# EAGLE design CARduino (EAGLE 7.1.0)
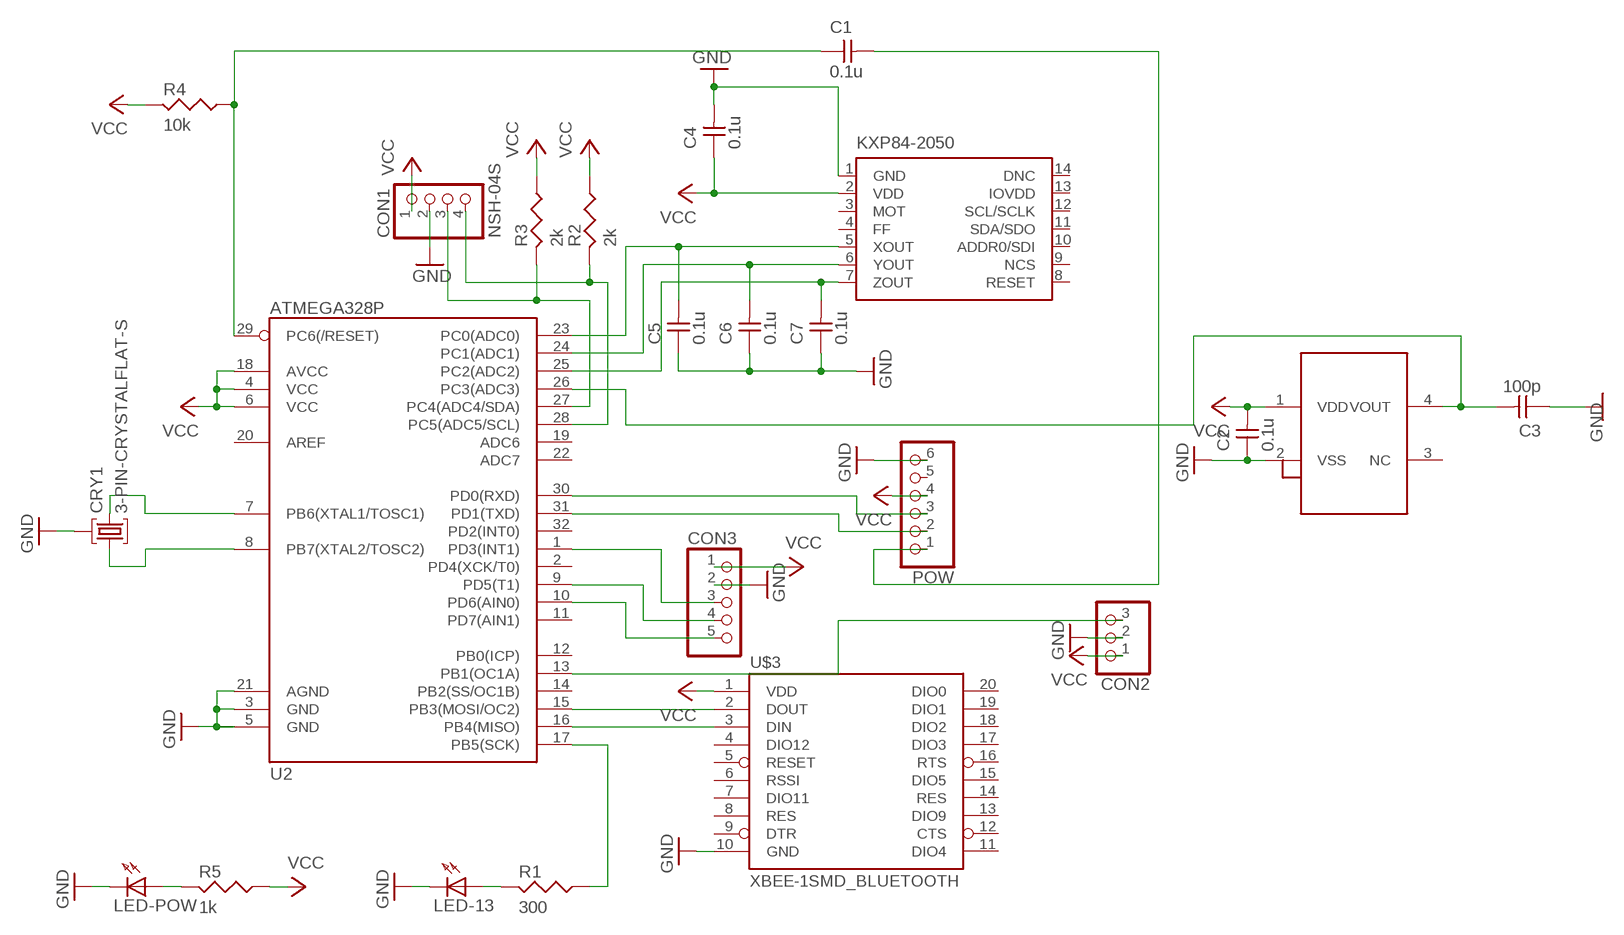
[diagram p0: schematic, sheet 1]

## Parts
C1  0.1u  1608  [1608]
C2  0.1u  1608  [1608]
C3  100p  1608  [1608]
C4  0.1u  1608  [1608]
C5  0.1u  1608  [1608]
C6  0.1u  1608  [1608]
C7  0.1u  1608  [1608]
CON1  NSH-04S  [NSH-04-S]
CON2  NSH-03S  [NSH-03-S]
CON3  PINHD-1X5DIP  [1X05]
CRY1  3-PIN-CRYSTALFLAT-S  [CRYSTAL-CSTCE8M]
LED-13  1608  [1608]
LED-POW  1608  [1608]
POW  PINHD-1X6NORMAL  [1X06]
R1  300  1608  [1608]
R2  2k  1608  [1608]
R3  2k  1608  [1608]
R4  10k  1608  [1608]
R5  1k  1608  [1608]
S1  TEMPERATURE-S8120C  [SC-82AB]
U2  ATMEGA328P  ATMEGA328_SMT  [TQFP32-08]
U$1  KXP84-2050  [DFN14-5X5]
U$3  XBEE-1SMD_BLUETOOTH  [XBEE-SMD_BLUETOOTH]

## Nets
GND: C2.P$1 C3.P$1 C4.P$2 C5.P$1 C6.P$1 C7.P$1 CON1.2 CON2.2 CON3.2 CRY1.G(GND) LED-13.C LED-POW.C POW.6 S1.2(VSS) U2.3(GND) U2.5(GND) U2.21(AGND) U$1.1(GND) U$3.10(GND)
N$1: CRY1.O1 U2.8(PB7(XTAL2/TOSC2))
N$2: CRY1.O2 U2.7(PB6(XTAL1/TOSC1))
N$3: C3.P$2 S1.4(VOUT) U2.26(PC3(ADC3))
N$5: C5.P$2 U2.23(PC0(ADC0)) U$1.5(XOUT)
N$6: C6.P$2 U2.24(PC1(ADC1)) U$1.6(YOUT)
N$7: U2.15(PB3(MOSI/OC2)) U$3.2(DOUT)
N$8: U2.16(PB4(MISO)) U$3.3(DIN)
N$9: C7.P$2 U2.25(PC2(ADC2)) U$1.7(ZOUT)
N$10: R1.1 U2.17(PB5(SCK))
N$11: LED-POW.A R5.2
N$12: LED-13.A R1.2
N$13: CON3.3 U2.1(PD3(INT1))
N$14: CON3.4 U2.9(PD5(T1))
N$15: CON2.3 U2.13(PB1(OC1A))
N$16: CON1.3 R3.2 U2.27(PC4(ADC4/SDA))
N$17: CON1.4 R2.2 U2.28(PC5(ADC5/SCL))
N$18: C1.P$2 POW.1
N$19: C1.P$1 R4.1 U2.29(PC6(/RESET))
N$20: POW.3 U2.30(PD0(RXD))
N$21: POW.2 U2.31(PD1(TXD))
N$22: CON3.5 U2.10(PD6(AIN0))
VCC: C2.P$2 C4.P$1 CON1.1 CON2.1 CON3.1 POW.4 R2.1 R3.1 R4.2 R5.1 S1.1(VDD) U2.4(VCC) U2.6(VCC) U2.18(AVCC) U$1.2(VDD) U$3.1(VDD)
Unconnected: POW.5 S1.3(NC) U2.2(PD4(XCK/T0)) U2.11(PD7(AIN1)) U2.12(PB0(ICP)) U2.14(PB2(SS/OC1B)) U2.19(ADC6) U2.20(AREF) U2.22(ADC7) U2.32(PD2(INT0)) U$1.3(MOT) U$1.4(FF) U$1.8(RESET) U$1.9(NCS) U$1.10(ADDR0/SDI) U$1.11(SDA/SDO) U$1.12(SCL/SCLK) U$1.14(DNC) U$3.4(DIO12) U$3.5(RESET) U$3.6(RSSI) U$3.7(DIO11) U$3.8(RES) U$3.9(DTR) U$3.11(DIO4) U$3.12(CTS) U$3.13(DIO9) U$3.14(RES) U$3.15(DIO5) U$3.16(RTS) U$3.17(DIO3) U$3.18(DIO2) U$3.19(DIO1) U$3.20(DIO0)

## Power pins joined to a net without a drawn wire
IOVDD: U$1.13(IOVDD)

## Library data of the parts
C1-C7 = 01_capacitor:1608
CON1 = 09_con-pin:NSH-04
CON2 = 09_con-pin:NSH-03
CON3 = 09_con-pin:PINHD-1X5: PIN HEADER
CRY1 = 00_other-parts:3-PIN-CRYSTAL: 3-pin crystal (center ground)
LED-13 LED-POW = 06_led:1608
POW = 09_con-pin:PINHD-1X6: PIN HEADER
R1-R5 = 02_resistor:1608
S1 = 00_other-parts:TEMPERATURE-S8120C
U2 = SparkFun-DigitalIC:ATMEGA328_SMT: 32-Pin Atmega328 part Commonly used on Arduino compatible boards Available in QFP and QFN packages TQFP is IC-09069 QFN is non-stock; PROD_ID: IC-09069
U$1 = linear-technology:KXP84-2050
U$3 = 00_other-parts:XBEE-1: Xbee module footprints SMT header is CONN-09042.

## Board
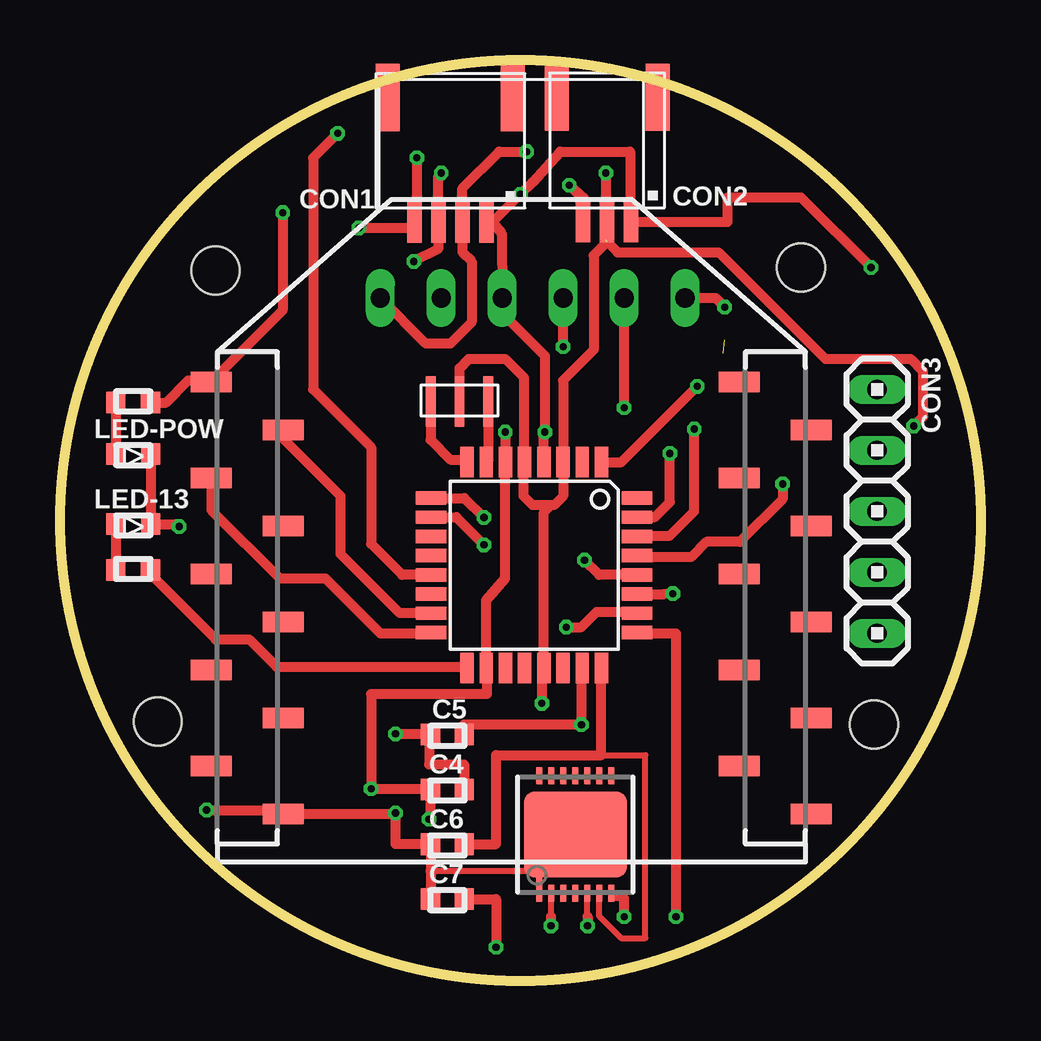
[diagram p1: board, top side]
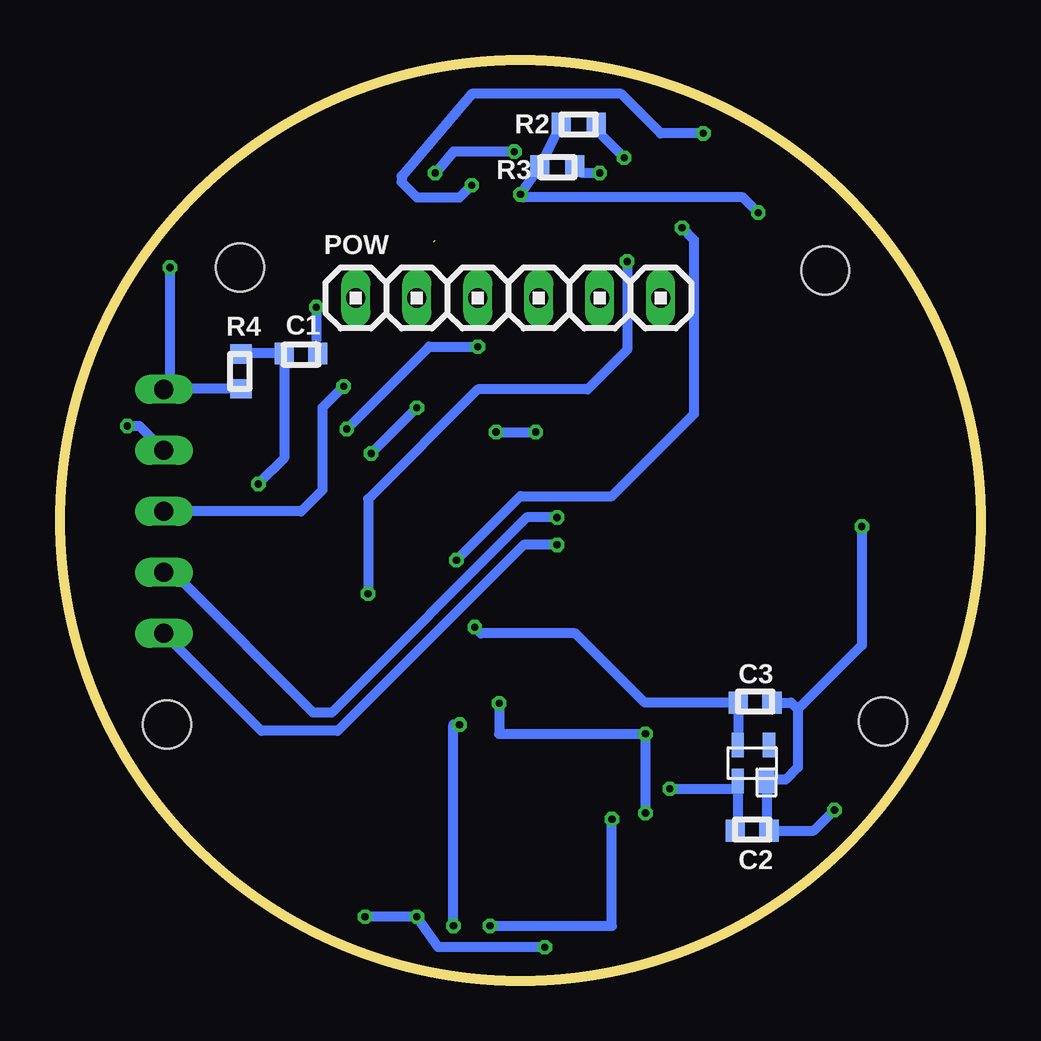
[diagram p2: board, bottom side, seen from below]

Size 38.37 x 38.37 mm. Coordinates in mm from the lower left corner, seen from the top.
Outline: circle at 19.19,19.19 radius 19.19
Copper layers (1*16): Top 0.035mm / dielectric 1.5mm / Bottom 0.035mm
Design rules "default": minimum track width 0.15mm, minimum drill 0.3mm, track to track 0.15mm, track to pad 0.15mm, pad to pad 0.15mm, via to via 0.15mm, smd to smd 0.15mm, copper to edge 0.7mm, drill to drill 0.45mm, minimum pad ring 0.15mm, minimum via ring 0.15mm, stop-mask expansion 4mil, vias tented up to drill 0mil, thermal gap 0.15mm
Holes 2 mm at 4.07,10.8 33.92,10.68 6.49,29.6 30.87,29.73

### Footprints (pad centres in the part's own frame; a part is rotated, then mirrored left to right if it is on the bottom)
1608 = smd 0.8 x 0.9: P$1 -0.7,0.1; P$2 0.7,0.1
NSH-04-S = smd 0.6 x 1.7: 1 1.5,-3.2; 2 0.5,-3.2; 3 -0.5,-3.2; 4 -1.5,-3.2 | smd 1 x 2.8: S1 2.6,2; S2 -2.6,2
NSH-03-S = smd 0.6 x 1.7: 1 1,-3.3; 2 0,-3.3; 3 -1,-3.3 | smd 1 x 2.8: S1 2.1,1.9; S2 -2.1,1.9
1X05 = drill 0.8 long: 1 -5.08,0; 2 -2.54,0; 3 0,0; 4 2.54,0; 5 5.08,0
CRYSTAL-CSTCE8M = smd 0.406 x 2.1: G 0,0; O1 -1.2,0; O2 1.2,0
1608' = smd 0.8 x 0.9: A -0.727,0.1; C 0.727,0.1
1X06 = drill 0.8 long: 1 -6.35,0; 2 -3.81,0; 3 -1.27,0; 4 1.27,0; 5 3.81,0; 6 6.35,0
1608'' = smd 0.8 x 0.9: 1 -0.715,0.037; 2 0.739,0.037
SC-82AB = smd 0.508 x 1.016: 1 -0.6,-0.7; 3 0.7,0.8; 4 -0.6,0.8 | smd 0.635 x 1.016: 2 0.6,-0.7
TQFP32-08 = smd 1.27 x 0.559: 1 -4.293,2.8; 2 -4.293,2; 3 -4.293,1.2; 4 -4.293,0.4; 5 -4.293,-0.4; 6 -4.293,-1.2; 7 -4.293,-2; 8 -4.293,-2.8; 17 4.293,-2.8; 18 4.293,-2; 19 4.293,-1.2; 20 4.293,-0.4; 21 4.293,0.4; 22 4.293,1.2; 23 4.293,2; 24 4.293,2.8 | smd 0.559 x 1.27: 9 -2.8,-4.293; 10 -2,-4.293; 11 -1.2,-4.293; 12 -0.4,-4.293; 13 0.4,-4.293; 14 1.2,-4.293; 15 2,-4.293; 16 2.8,-4.293; 25 2.8,4.293; 26 2,4.293; 27 1.2,4.293; 28 0.4,4.293; 29 -0.4,4.293; 30 -1.2,4.293; 31 -2,4.293; 32 -2.8,4.293
DFN14-5X5 = smd 0.25 x 1.97: 1 -1.5,-1.815 | smd 0.25 x 0.7: 2 -1,-2.45; 3 -0.5,-2.45; 4 0,-2.45; 5 0.5,-2.45; 6 1,-2.45; 7 1.5,-2.45; 8 1.5,2.45; 9 1,2.45; 10 0.5,2.45; 11 0,2.45; 12 -0.5,2.45; 13 -1,2.45; 14 -1.5,2.45 | smd 4.3 x 3.6: CENTERPAD 0,0
XBEE-SMD_BLUETOOTH = smd 1.7 x 0.85: 1 -12.5,20; 2 -9.5,18; 3 -12.5,16; 4 -9.5,14; 5 -12.5,12; 6 -9.5,10; 7 -12.5,8; 8 -9.5,6; 9 -12.5,4; 10 -9.5,2; 11 12.5,2; 12 9.5,4; 13 12.5,6; 14 9.5,8; 15 12.5,10; 16 9.5,12; 17 12.5,14; 18 9.5,16; 19 12.5,18; 20 9.5,20

### Placement (x,y rotation side)
C1  28.33,26.04 0 bottom
C2  9.53,6.36 180 bottom
C3  9.41,11.69 180 bottom
C4  16.14,7.88 0 top
C5  16.14,10.17 0 top
C6  16.14,5.6 0 top
C7  16.14,3.31 0 top
CON1  16.27,34.81 0 top
CON2  22.8,34.92 0 top
CON3  34.05,19.57 270 top
CRY1  16.65,24.14 0 top
LED-13  1608  [1608']  3.06,18.93 0 top
LED-POW  1608  [1608']  3.06,21.85 0 top
POW  19.69,28.46 0 bottom
R1  300  [1608'']  3.06,17.15 180 top
R2  2k  [1608'']  16.77,35.7 0 bottom
R3  2k  [1608'']  17.66,33.92 0 bottom
R4  10k  [1608'']  30.87,25.41 270 bottom
R5  1k  [1608'']  3.06,24.14 180 top
S1  9.53,9.03 0 bottom
U2  19.76,17.32 270 top
U$1  21.47,6.11 0 top
U$3  18.81,4.96 0 top

### Tracks (layer width: path | path; a pad name or v marks a point on that pad's centre or on a via)
GND  (via drill 0.3)  (1 unrouted)
  Top 0.254: C7.P$1 15.38,3.41 | U$1.1 19.95,4.29 19.95,4.58 15.44,4.58
  Top 0.305: 22.74,30.87 22.74,31.51
  Top 0.406: 20.46,19.82 20.58,19.82 20.96,20.2 U2.3 20.96,21.62 20.96,25.03 22.23,26.3 22.23,30.24 22.8,30.8 | 20.46,19.82 19.69,19.82 19.31,20.2 19.31,21.57 U2.5 19.31,21.66 19.31,25.16 18.55,25.92 17.03,25.92 16.65,25.54 CRY1.G | v19.44,34.55 18.3,34.55 16.77,33.02 CON1.2 16.77,30.37 17.15,29.98 17.15,27.44 16.27,26.55 15.25,26.55 POW.6 | v22.74,33.66 22.74,31.68 CON2.2 22.8,30.8 | 20.46,19.82 20.16,19.52 U2.21 20.08,13.03 v20.08,11.57 | LED-POW.C LED-13.C 4.86,19.03 v4.96,18.93 | v6.11,7.12 9.15,7.12 U$3.10 | v35.57,23.12 35.95,23.5 35.95,25.41 35.44,25.92 31.89,25.92 27.44,30.36 23.23,30.36 22.8,30.8 | v13.98,10.3 15.44,10.3 C5.P$1 15.38,10.27 15.38,9.03 16.84,9.03 C4.P$2 | 9.31,6.99 U$3.10 | C7.P$1 15.44,4.58 C6.P$1 13.98,5.7 v13.98,6.99 13.98,6.96 U$3.10
  Bottom 0.406: v19.44,34.55 21.98,34.55 v22.74,33.66 | v35.57,23.12 35.06,23.12 CON3.2 | C3.P$1 7.91,11.59 7.63,11.31 | 7.63,11.31 7.63,8.9 8.14,8.39 8.87,8.39 S1.2 8.93,6.36 C2.P$1 6.97,6.26 v6.11,7.12 | v4.96,18.93 4.96,13.98 7.63,11.31 | v20.08,11.57 20.08,10.3 v13.98,10.3 v13.98,6.99
N$1
  Top 0.406: CRY1.O1 15.45,22.55 16.27,21.73 16.85,21.73 U2.8
N$2
  Top 0.406: CRY1.O2 17.85,21.7 U2.7
N$3  (via drill 0.3)
  Top 0.406: v21.09,14.74 21.73,14.74 22.36,15.38 23.89,15.38 24.01,15.25 24.12,15.25 | 24.39,15.25 24.12,15.25 | 24.12,15.25 U2.26
  Bottom 0.406: S1.4 10.11,9.85 C3.P$2 14.01,11.59 16.9,14.49 20.84,14.49 v21.09,14.74
N$5  (via drill 0.3)
  Top 0.254: 21.98,2.68 21.97,2.68 U$1.5
  Top 0.406: U2.23 21.73,13.03 v21.73,10.68 16.84,10.68 C5.P$2 | 21.98,2.68 v21.98,2.3
  Bottom 0.406: v21.98,2.3 21.98,10.68 v21.73,10.68
N$6
  Top 0.254: 22.56,9.41 24.39,9.41 24.39,1.79 23.38,1.79 22.49,2.68 22.47,2.68 U$1.6
  Top 0.406: C6.P$2 18.17,5.7 18.17,9.41 22.56,9.41 U2.24
N$7
  Top 0.406: U$3.2 9.31,22.59 11.69,20.2 11.69,17.79 14.16,15.32 U2.15
N$8
  Top 0.406: U$3.3 6.31,19.62 9.15,16.77 11.06,16.77 13.34,14.49 15.43,14.49 U2.16
N$9  (via drill 0.3)
  Top 0.254: 23.5,3.44 22.97,3.44 U$1.7
  Top 0.406: U2.25 24.05,14.49 25.66,14.49 v25.66,2.68 | v23.5,2.68 23.5,3.44 | C7.P$2 18.17,3.41 v18.17,1.41
  Bottom 0.406: v25.66,2.68 v23.5,2.68 22.62,1.41 v18.17,1.41
N$10
  Top 0.406: R1.1 3.77,16.95 6.49,14.23 7.88,14.23 9.03,13.09 16.9,13.09 U2.17
N$11
  Top 0.406: R5.2 2.32,21.75 2.3,21.73 2.3,21.85 | 2.4,21.95 2.3,21.85 | LED-POW.A 2.4,21.95 | 2.4,21.95 2.42,21.98 2.42,21.85 2.3,21.85
N$12
  Top 0.406: LED-13.A 2.32,19.03 R1.2
N$13  (via drill 0.3)
  Top 0.406: U2.1 23.39,21.62 v26.55,24.77
  Bottom 0.406: v26.55,24.77 27.44,23.89 27.44,20.46 28.33,19.57 CON3.3
N$14  (via drill 0.3)
  Top 0.406: U2.9 16.85,20.12 v17.66,19.31
  Bottom 0.406: v17.66,19.31 18.93,19.31 27.06,11.19 27.82,11.19 33.41,16.77 33.79,16.77 CON3.4
N$15  (via drill 0.3)
  Top 0.406: CON2.3 21.8,32.14 | 21.8,32.14 21.8,32.58 v21.22,33.16 | v21.22,33.16 21.35,33.03 | U2.13 14.26,16.92 12.96,18.21 12.96,22.23 10.55,24.65 10.55,34.3 v11.57,35.32 | v21.22,33.16 21.85,32.59 21.8,32.14
  Bottom 0.406: v11.57,35.32 13.34,35.32 15,36.97 21.22,36.97 24.14,33.54 24.14,33.28 23.5,32.65 21.73,32.65 v21.22,33.16
N$16  (via drill 0.3)
  Top 0.305: CON1.3 15.77,31.01
  Top 0.406: CON1.3 15.77,33.55 v15.88,33.66 | U2.27 25.17,16.12 v25.54,16.14 | v14.74,29.98 15.76,30.49 15.77,31.01
  Bottom 0.406: v15.88,33.66 16.63,33.66 R3.2 | v14.74,29.98 14.74,26.3 16.39,24.65 20.96,24.65 25.54,20.08 v25.54,16.14
N$17  (via drill 0.3)
  Top 0.406: v14.87,34.3 14.87,31.71 CON1.4 14.54,31.38 v12.46,31.38 | U2.28 22.47,16.92 v21.85,17.54
  Bottom 0.406: R2.2 16.03,35.47 v14.87,34.3 | v21.85,17.54 19.19,20.2 15.38,20.2 11.95,23.63 11.95,30.87 v12.46,31.38
N$18  (via drill 0.3)  (1 unrouted)
  Top 0.406: POW.1 27.31,28.46 v27.7,28.08
  Bottom 0.406: v27.7,28.08 27.7,26.72
N$19  (via drill 0.3)
  Top 0.406: v30.11,20.71 30.11,20.08 28.33,18.3 26.93,18.3 26.3,17.66 24.11,17.66 U2.29
  Bottom 0.406: v30.11,20.71 29.03,21.79 C1.P$1 30.83,26.14 R4.1 30.81,26.14
N$20  (via drill 0.3)
  Top 0.406: U2.30 24.08,18.55 25.41,18.55 26.43,19.57 v26.43,23 | v20.96,26.43 POW.3
  Bottom 0.406: v20.96,26.43 23,26.43 v26.43,23
N$21  (via drill 0.3)
  Top 0.406: U2.31 24.78,19.32 25.41,19.95 v25.41,21.98 | v23.5,23.89 POW.2
  Bottom 0.406: v23.5,23.89 v25.41,21.98
N$22  (via drill 0.3)
  Top 0.406: U2.10 16.51,19.32 v17.66,18.17
  Bottom 0.406: v17.66,18.17 19.06,18.17 26.81,10.42 29.98,10.42 CON3.5
VCC  (via drill 0.3)
  Top 0.254: 20.46,2.68 20.47,2.69 U$1.2
  Top 0.406: v33.79,29.73 30.87,32.65 27.82,32.65 27.82,31.63 25.4,31.62 CON2.1 23.76,31.66 23.76,34.55 20.84,34.55 19.69,33.28 v19.19,32.78 18.02,31.61 | CON1.1 18.02,31.61 | U2.4 20.16,22.83 v20.2,22.87 20.2,26.04 18.42,27.82 POW.4 18.4,31.15 18.02,31.61 | v18.55,22.87 18.55,21.62 U2.6 18.55,21.5 18.55,16.77 17.76,15.85 U2.18 17.79,13.03 17.79,11.95 12.96,11.95 v12.96,8.01 15.44,8.01 C4.P$1 15.44,6.74 v15.38,6.74 | R5.1 4.42,24.1 5.34,25.03 6.24,25.03 U$3.1 9.28,27.94 v9.28,32.01 | 20.46,2.68 v20.46,2.3
  Bottom 0.406: v20.2,22.87 v18.55,22.87 | v33.79,29.73 33.79,24.9 CON3.1 34.02,24.67 R4.2 | C2.P$2 10.13,6.36 S1.1 10.13,8.01 v12.96,8.01 | v9.28,32.01 9.92,32.65 19.06,32.65 v19.19,32.78 R3.1 R2.1 | v20.46,2.3 15.38,2.3 v15.38,6.74